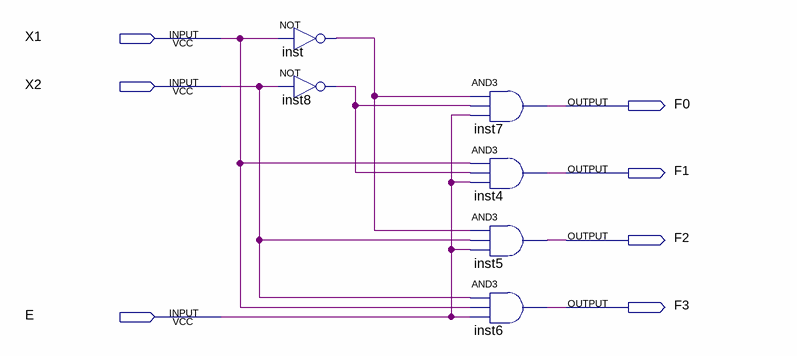
[diagram p0: schematic sheet]
// Quartus schematic dmx14.bdf as structural Verilog: 6 symbols, 7 pins
module dmx14 (
  input  X1,
  input  X2,
  input  E,
  output F0,
  output F1,
  output F2,
  output F3
);

  wire inst8_out, inst_out;

  not inst (inst_out, X1);
  not inst8 (inst8_out, X2);
  and inst7 (F0, inst_out, inst8_out, E);
  and inst4 (F1, X1, inst8_out, E);
  and inst5 (F2, inst_out, X2, E);
  and inst6 (F3, X2, X1, E);
endmodule
